# Altium schematic sheet PFC_Controller.SchDoc
size A3; SheetNumber: 3; SheetTotal: 9
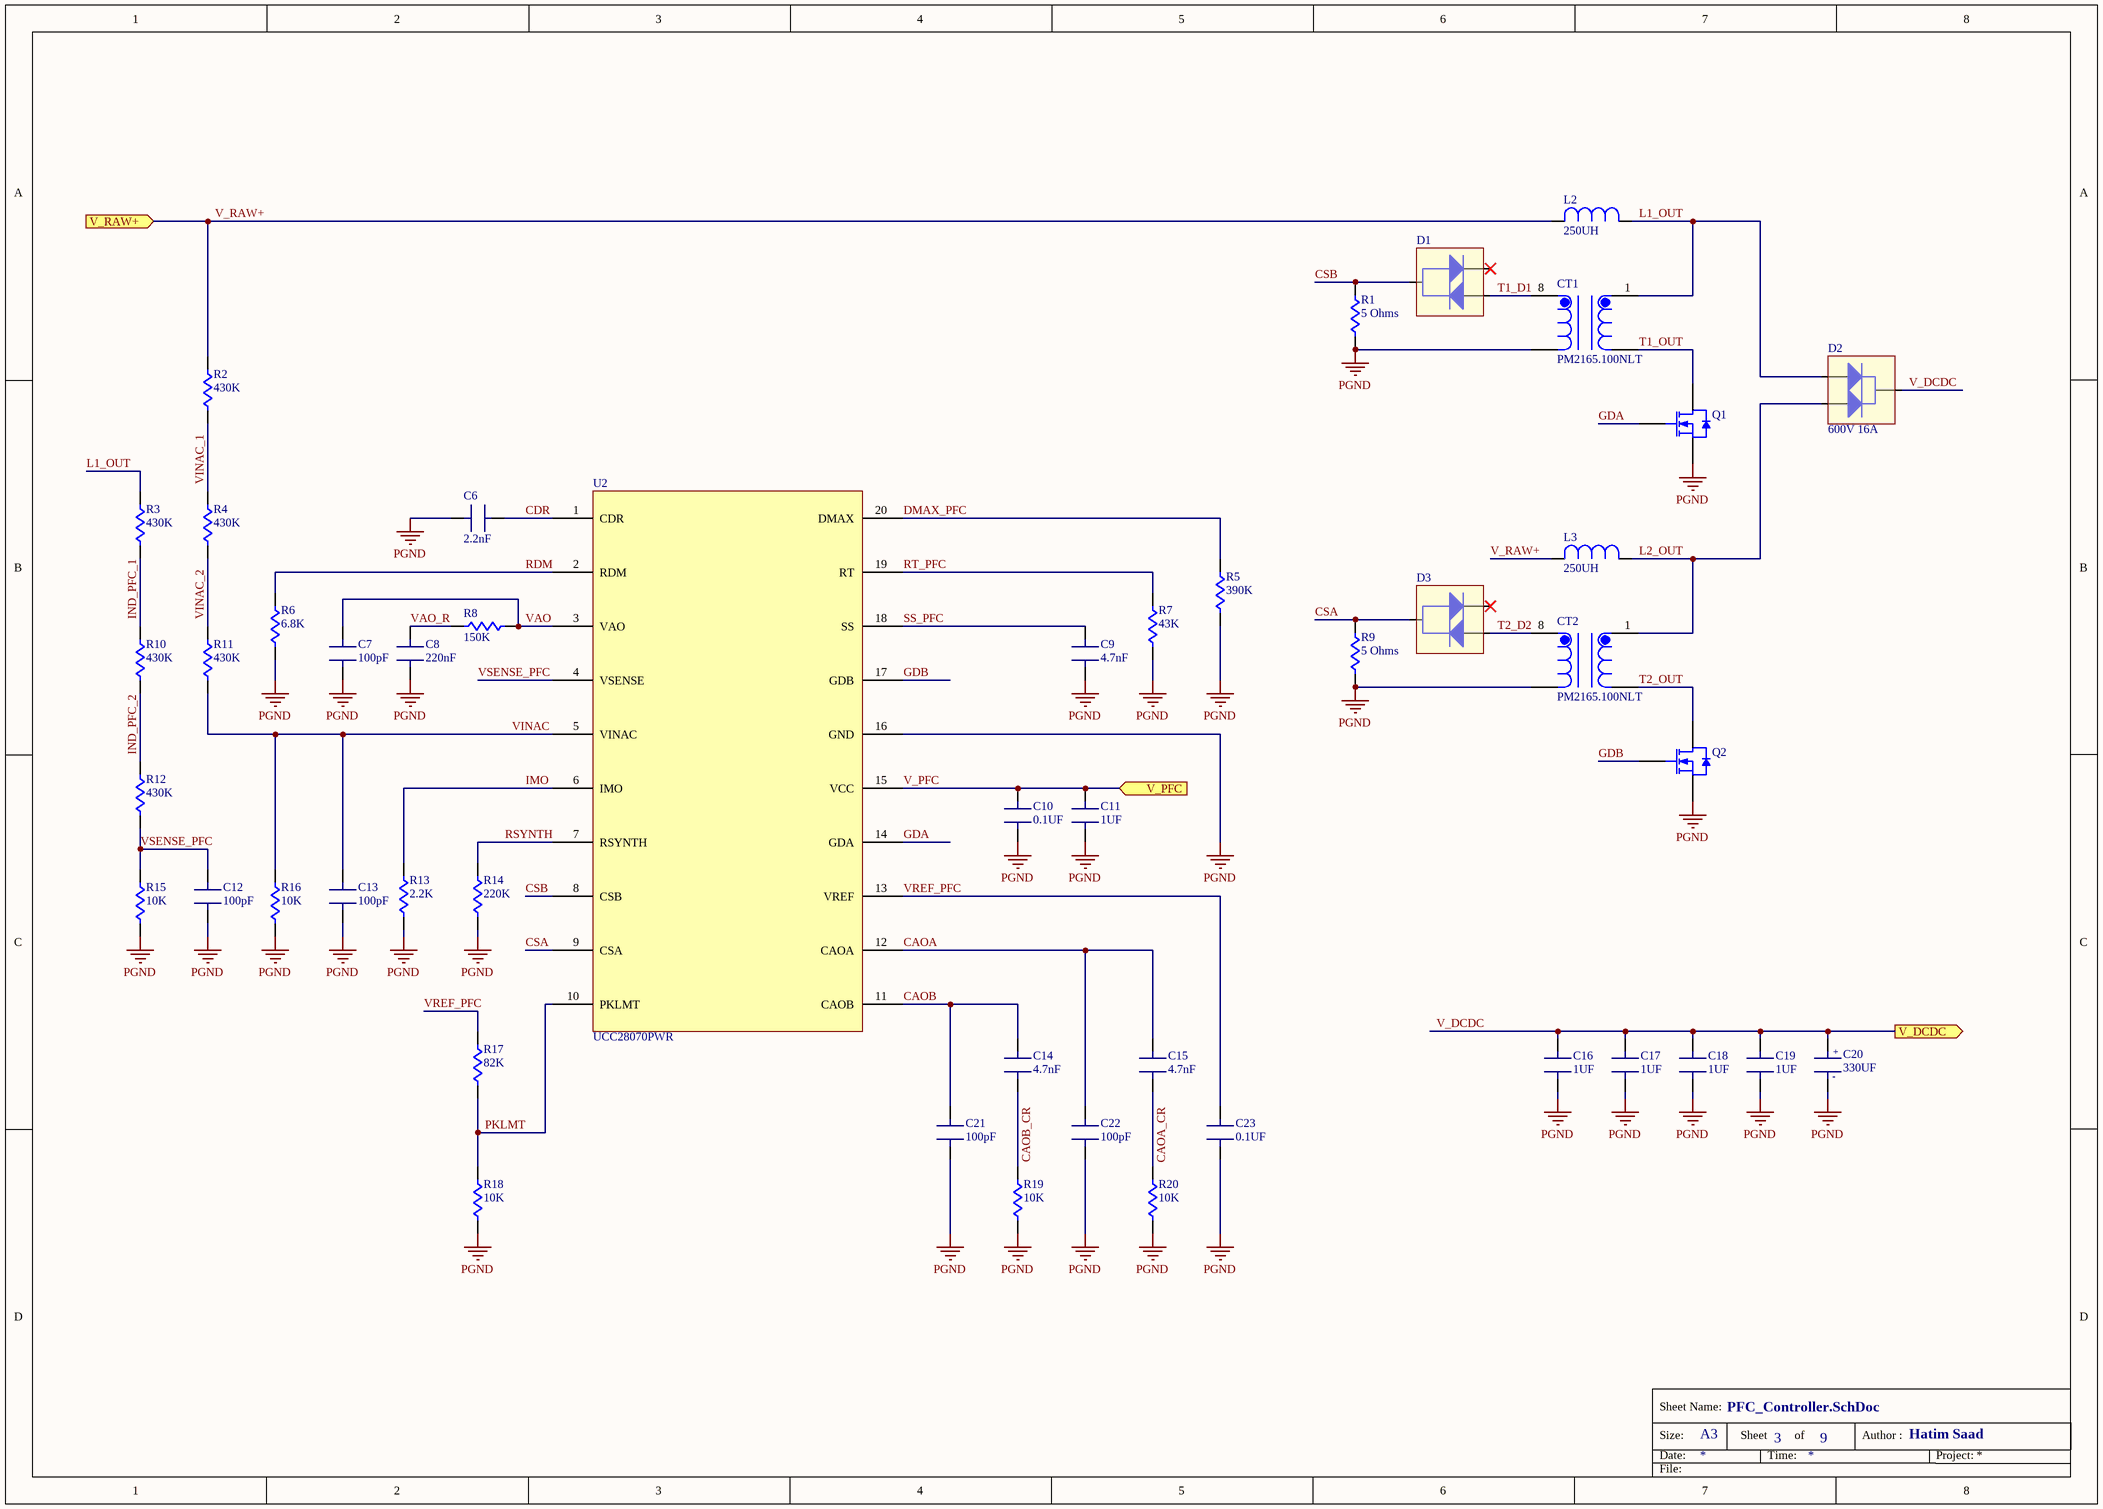
[diagram p0: PFC_Controller.SchDoc]

## Parts
C6  2.2nF  [CAP: 0603]
C7  100pF  [CAP: 0603]
C8  220nF  [CAP: 0603]
C9  4.7nF  [CAP: 0603]
C10  0.1UF  [CAP: 0603]
C11  1UF  [CAP: 0603]
C12  100pF  [CAP: 0603]
C13  100pF  [CAP: 0603]
C14  4.7nF  [CAP: 0603]
C15  4.7nF  [CAP: 0603]
C16  1UF  [CAP: 2220]
C17  1UF  [CAP: 2220]
C18  1UF  [CAP: 2220]
C19  1UF  [CAP: 2220]
C20  330UF  [CAP: 10MM D: 35MM L: 25MM Snap In]
C21  100pF  [CAP: 0603]
C22  100pF  [CAP: 0603]
C23  0.1UF  [CAP: 0603]
CT1  PM2165.100NLT  [CT: PM2165.100NLT]
CT2  PM2165.100NLT  [CT: PM2165.100NLT]
D1  BAT54SWT1G  [SOT323]  (value not drawn)
D2  600V 16A  [D2PAK]
D3  BAT54SWT1G  [SOT323]  (value not drawn)
L2  250UH  [IND: ATCA-08-251M-H]
L3  250UH  [IND: ATCA-08-251M-H]
Q1  IPT60R099CM8XTMA1  [8-HSOF]  (value not drawn)
Q2  IPT60R099CM8XTMA1  [8-HSOF]  (value not drawn)
R1  5 Ohms  [RES: 1206]
R2  430K  [RES: 2512]
R3  430K  [RES: 2512]
R4  430K  [RES: 2512]
R5  390K  [RES: 0603]
R6  6.8K  [RES: 0603]
R7  43K  [RES: 0603]
R8  150K  [RES: 0603]
R9  5 Ohms  [RES: 1206]
R10  430K  [RES: 2512]
R11  430K  [RES: 2512]
R12  430K  [RES: 2512]
R13  2.2K  [RES: 0603]
R14  220K  [RES: 0603]
R15  10K  [RES: 0603]
R16  10K  [RES: 0603]
R17  82K  [RES: 0603]
R18  10K  [RES: 0603]
R19  10K  [RES: 0603]
R20  10K  [RES: 0603]
U2  UCC28070PWR  [20-TSSOP]

## Ports
V_DCDC (out), V_PFC (in), V_RAW+ (in)

## Nets
PGND: C6.2(B) C7.1(A) C8.1(A) C9.1(A) C10.1(A) C11.1(A) C12.1(A) C13.1(A) C16.1(A) C17.1(A) C18.1(A) C19.1(A) C20.2(-) C21.1(A) C22.1(A) C23.1(A) CT1.7(S) CT2.7(S) Q1.3(S) Q2.3(S) R1.1 R5.1 R6.1 R7.1 R9.1 R13.1 R14.1 R15.1 R16.1 R18.1 R19.1 R20.1 U2.16(GND)
CAOA: C15.2(B) C22.2(B) U2.12(CAOA)
CAOA_CR: C15.1(A) R20.2
CAOB: C14.2(B) C21.2(B) U2.11(CAOB)
CAOB_CR: C14.1(A) R19.2
CDR: C6.1(A) U2.1(CDR)
CSA: D3.3(A/K) R9.2 U2.9(CSA)
CSB: D1.3(A/K) R1.2 U2.8(CSB)
DMAX_PFC: R5.2 U2.20(DMAX)
GDA: Q1.1(G) U2.14(GDA)
GDB: Q2.1(G) U2.17(GDB)
IMO: R13.2 U2.6(IMO)
IND_PFC_1: R3.1 R10.2
IND_PFC_2: R10.1 R12.2
L1_OUT: CT1.1(P) D2.1(A) L2.2 R3.2
L2_OUT: CT2.1(P) D2.3(A) L3.2
PKLMT: R17.1 R18.2 U2.10(PKLMT)
RDM: R6.2 U2.2(RDM)
RSYNTH: R14.2 U2.7(RSYNTH)
RT_PFC: R7.2 U2.19(RT)
SS_PFC: C9.2(B) U2.18(SS)
T1_D1: CT1.8(S) D1.1(A)
T1_OUT: CT1.3(P) Q1.2(D)
T2_D2: CT2.8(S) D3.1(A)
T2_OUT: CT2.3(P) Q2.2(D)
V_DCDC: C16.2(B) C17.2(B) C18.2(B) C19.2(B) C20.1(+) D2.2(K) ; port V_DCDC
V_PFC: C10.2(B) C11.2(B) U2.15(VCC) ; port V_PFC
V_RAW+: L2.1 L3.1 R2.2 ; port V_RAW+
VAO: C7.2(B) R8.2 U2.3(VAO)
VAO_R: C8.2(B) R8.1
VINAC: C13.2(B) R11.1 R16.2 U2.5(VINAC)
VINAC_1: R2.1 R4.2
VINAC_2: R4.1 R11.2
VREF_PFC: C23.2(B) R17.2 U2.13(VREF)
VSENSE_PFC: C12.2(B) R12.1 R15.2 U2.4(VSENSE)

Not connected (* = marked no-connect by the designer): D1 2(K)*; D3 2(K)*

## Notes on the sheet
- Size:
- Date:
- Sheet Name:
- A3
- Sheet
- Time:
- of
- Author :
- Hatim Saad
- Project:
- File:

## Library data of the parts
C6-C15 C21-C23 = CAP 0603: CAP SMD 0603
C16-C19 = GR355XD7LP105KW05L: Multilayer Ceramic Capacitors MLCC - SMD/SMT 1 uF 450 VDC 10% 2220 X7T; Supplier 1: Mouser; Supplier Part Number 1: 81-GR355X7LP105KW05L
C20 = ESMR451VSN331MA25S: Aluminium Electrolytic Capacitors - Snap In 450V 330uF 20% Tol.; Supplier 1: Mouser; Supplier Part Number 1: 661-ESMR451N331MA25S
CT1 CT2 = PM2165.100NLT: Current Transformers 2mH 1000V AEC-Q200 20A DCR=0.75mOhms; Supplier 1: Mouser; Supplier Part Number 1: 673-PM2165.100NLT
D1 D3 = BAT54SWT1G: Schottky Diodes & Rectifiers 30V 200mW Dual; Supplier 1: Mouser; Supplier Part Number 1: 863-BAT54SWT1G
D2 = VS-HFA16TA60CS-M3: Schottky Diodes & Rectifiers 600V 16A TO-263 HexFred; Supplier 1: Mouser; Supplier Part Number 1: 78-VS-HFA16TA60CS-M3
L2 L3 = ATCA-08-251M-H: FIXED IND 250UH 10A 27 MOHM TH; Supplier 1: Mouser; Supplier Part Number 1: 815-ATCA-08-251M-H
Q1 Q2 = IPT60R099CM8XTMA1: MOSFETs 600V CoolMOS CM8 Power Transistor; Supplier 1: Mouser; Supplier Part Number 1: 726-IPT60R099CM8XTMA
R1 R9 = CSRT1206FT5R00: Current Sense Resistors - SMD 5Ohms 1206 1W 1% Thin Curr Sens AEC-Q200; Supplier 1: Mouser; Supplier Part Number 1: 708-CSRT1206FT5R00
R2-R4 R10-R12 = RES 2512: RES SMD 2512
R5-R8 R13-R20 = RES 0603: RES SMD 0603
U2 = UCC28070PWR: Power Factor Correction - PFC 2Phase Interleaved C CM PFC Controller A 595-UCC28070PW; Supplier 1: Mouser; Supplier Part Number 1: 595-UCC28070PWR